# EAGLE design HP32W_proto (EAGLE 7.2.0)
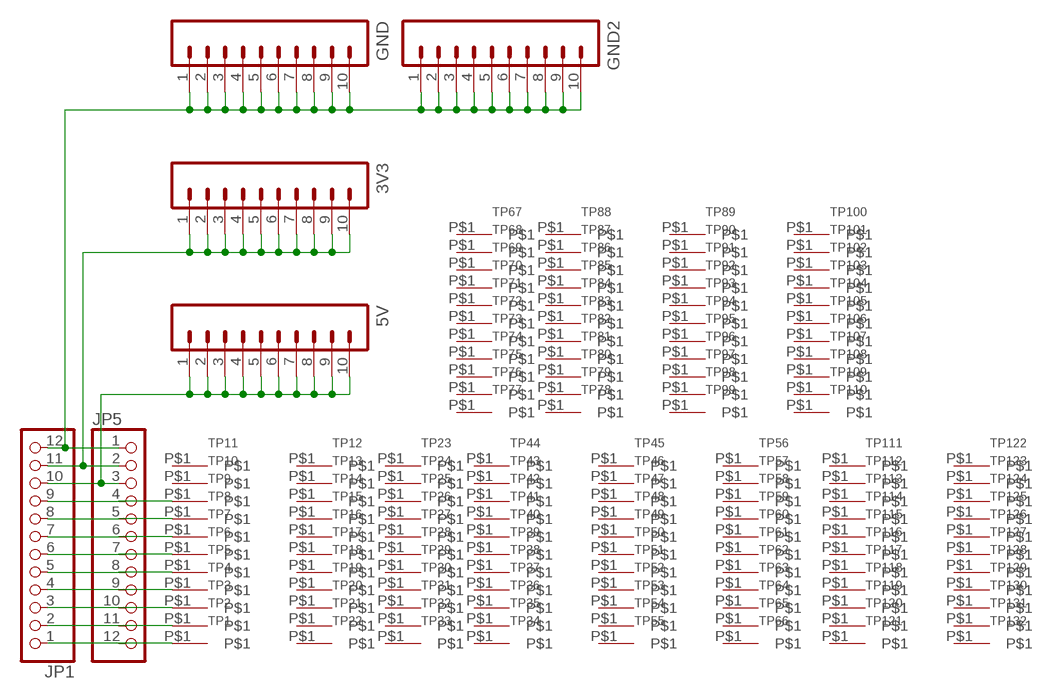
[diagram p0: schematic, sheet 1]

## Parts
3V3  M10"  [1X10]
5V  M10"  [1X10]
GND  M10"  [1X10]
GND2  M10"  [1X10]
JP1  PINHD-1X12-CB  [1X12-CB]
JP5  PINHD-1X12-CB  [1X12-CB]
TP1  FLOWERPIN  [FLOWERPIN]
TP2  FLOWERPIN  [FLOWERPIN]
TP3  FLOWERPIN  [FLOWERPIN]
TP4  FLOWERPIN  [FLOWERPIN]
TP5  FLOWERPIN  [FLOWERPIN]
TP6  FLOWERPIN  [FLOWERPIN]
TP7  FLOWERPIN  [FLOWERPIN]
TP8  FLOWERPIN  [FLOWERPIN]
TP9  FLOWERPIN  [FLOWERPIN]
TP10  FLOWERPIN  [FLOWERPIN]
TP11  FLOWERPIN  [FLOWERPIN]
TP12  FLOWERPIN  [FLOWERPIN]
TP13  FLOWERPIN  [FLOWERPIN]
TP14  FLOWERPIN  [FLOWERPIN]
TP15  FLOWERPIN  [FLOWERPIN]
TP16  FLOWERPIN  [FLOWERPIN]
TP17  FLOWERPIN  [FLOWERPIN]
TP18  FLOWERPIN  [FLOWERPIN]
TP19  FLOWERPIN  [FLOWERPIN]
TP20  FLOWERPIN  [FLOWERPIN]
TP21  FLOWERPIN  [FLOWERPIN]
TP22  FLOWERPIN  [FLOWERPIN]
TP23  FLOWERPIN  [FLOWERPIN]
TP24  FLOWERPIN  [FLOWERPIN]
TP25  FLOWERPIN  [FLOWERPIN]
TP26  FLOWERPIN  [FLOWERPIN]
TP27  FLOWERPIN  [FLOWERPIN]
TP28  FLOWERPIN  [FLOWERPIN]
TP29  FLOWERPIN  [FLOWERPIN]
TP30  FLOWERPIN  [FLOWERPIN]
TP31  FLOWERPIN  [FLOWERPIN]
TP32  FLOWERPIN  [FLOWERPIN]
TP33  FLOWERPIN  [FLOWERPIN]
TP34  FLOWERPIN  [FLOWERPIN]
TP35  FLOWERPIN  [FLOWERPIN]
TP36  FLOWERPIN  [FLOWERPIN]
TP37  FLOWERPIN  [FLOWERPIN]
TP38  FLOWERPIN  [FLOWERPIN]
TP39  FLOWERPIN  [FLOWERPIN]
TP40  FLOWERPIN  [FLOWERPIN]
TP41  FLOWERPIN  [FLOWERPIN]
TP42  FLOWERPIN  [FLOWERPIN]
TP43  FLOWERPIN  [FLOWERPIN]
TP44  FLOWERPIN  [FLOWERPIN]
TP45  FLOWERPIN  [FLOWERPIN]
TP46  FLOWERPIN  [FLOWERPIN]
TP47  FLOWERPIN  [FLOWERPIN]
TP48  FLOWERPIN  [FLOWERPIN]
TP49  FLOWERPIN  [FLOWERPIN]
TP50  FLOWERPIN  [FLOWERPIN]
TP51  FLOWERPIN  [FLOWERPIN]
TP52  FLOWERPIN  [FLOWERPIN]
TP53  FLOWERPIN  [FLOWERPIN]
TP54  FLOWERPIN  [FLOWERPIN]
TP55  FLOWERPIN  [FLOWERPIN]
TP56  FLOWERPIN  [FLOWERPIN]
TP57  FLOWERPIN  [FLOWERPIN]
TP58  FLOWERPIN  [FLOWERPIN]
TP59  FLOWERPIN  [FLOWERPIN]
TP60  FLOWERPIN  [FLOWERPIN]
TP61  FLOWERPIN  [FLOWERPIN]
TP62  FLOWERPIN  [FLOWERPIN]
TP63  FLOWERPIN  [FLOWERPIN]
TP64  FLOWERPIN  [FLOWERPIN]
TP65  FLOWERPIN  [FLOWERPIN]
TP66  FLOWERPIN  [FLOWERPIN]
TP67  FLOWERPIN  [FLOWERPIN]
TP68  FLOWERPIN  [FLOWERPIN]
TP69  FLOWERPIN  [FLOWERPIN]
TP70  FLOWERPIN  [FLOWERPIN]
TP71  FLOWERPIN  [FLOWERPIN]
TP72  FLOWERPIN  [FLOWERPIN]
TP73  FLOWERPIN  [FLOWERPIN]
TP74  FLOWERPIN  [FLOWERPIN]
TP75  FLOWERPIN  [FLOWERPIN]
TP76  FLOWERPIN  [FLOWERPIN]
TP77  FLOWERPIN  [FLOWERPIN]
TP78  FLOWERPIN  [FLOWERPIN]
TP79  FLOWERPIN  [FLOWERPIN]
TP80  FLOWERPIN  [FLOWERPIN]
TP81  FLOWERPIN  [FLOWERPIN]
TP82  FLOWERPIN  [FLOWERPIN]
TP83  FLOWERPIN  [FLOWERPIN]
TP84  FLOWERPIN  [FLOWERPIN]
TP85  FLOWERPIN  [FLOWERPIN]
TP86  FLOWERPIN  [FLOWERPIN]
TP87  FLOWERPIN  [FLOWERPIN]
TP88  FLOWERPIN  [FLOWERPIN]
TP89  FLOWERPIN  [FLOWERPIN]
TP90  FLOWERPIN  [FLOWERPIN]
TP91  FLOWERPIN  [FLOWERPIN]
TP92  FLOWERPIN  [FLOWERPIN]
TP93  FLOWERPIN  [FLOWERPIN]
TP94  FLOWERPIN  [FLOWERPIN]
TP95  FLOWERPIN  [FLOWERPIN]
TP96  FLOWERPIN  [FLOWERPIN]
TP97  FLOWERPIN  [FLOWERPIN]
TP98  FLOWERPIN  [FLOWERPIN]
TP99  FLOWERPIN  [FLOWERPIN]
TP100  FLOWERPIN  [FLOWERPIN]
TP101  FLOWERPIN  [FLOWERPIN]
TP102  FLOWERPIN  [FLOWERPIN]
TP103  FLOWERPIN  [FLOWERPIN]
TP104  FLOWERPIN  [FLOWERPIN]
TP105  FLOWERPIN  [FLOWERPIN]
TP106  FLOWERPIN  [FLOWERPIN]
TP107  FLOWERPIN  [FLOWERPIN]
TP108  FLOWERPIN  [FLOWERPIN]
TP109  FLOWERPIN  [FLOWERPIN]
TP110  FLOWERPIN  [FLOWERPIN]
TP111  FLOWERPIN  [FLOWERPIN]
TP112  FLOWERPIN  [FLOWERPIN]
TP113  FLOWERPIN  [FLOWERPIN]
TP114  FLOWERPIN  [FLOWERPIN]
TP115  FLOWERPIN  [FLOWERPIN]
TP116  FLOWERPIN  [FLOWERPIN]
TP117  FLOWERPIN  [FLOWERPIN]
TP118  FLOWERPIN  [FLOWERPIN]
TP119  FLOWERPIN  [FLOWERPIN]
TP120  FLOWERPIN  [FLOWERPIN]
TP121  FLOWERPIN  [FLOWERPIN]
TP122  FLOWERPIN  [FLOWERPIN]
TP123  FLOWERPIN  [FLOWERPIN]
TP124  FLOWERPIN  [FLOWERPIN]
TP125  FLOWERPIN  [FLOWERPIN]
TP126  FLOWERPIN  [FLOWERPIN]
TP127  FLOWERPIN  [FLOWERPIN]
TP128  FLOWERPIN  [FLOWERPIN]
TP129  FLOWERPIN  [FLOWERPIN]
TP130  FLOWERPIN  [FLOWERPIN]
TP131  FLOWERPIN  [FLOWERPIN]
TP132  FLOWERPIN  [FLOWERPIN]

## Nets
N$1: GND2.1 GND2.2 GND2.3 GND2.4 GND2.5 GND2.6 GND2.7 GND2.8 GND2.9 GND2.10 GND.1 GND.2 GND.3 GND.4 GND.5 GND.6 GND.7 GND.8 GND.9 GND.10 JP1.12 JP5.1
N$2: 3V3.1 3V3.2 3V3.3 3V3.4 3V3.5 3V3.6 3V3.7 3V3.8 3V3.9 3V3.10 JP1.11 JP5.2
N$3: 5V.1 5V.2 5V.3 5V.4 5V.5 5V.6 5V.7 5V.8 5V.9 5V.10 JP1.10 JP5.3
N$4: JP1.9 JP5.4 TP9.P$1
N$5: JP1.8 JP5.5 TP8.P$1
N$6: JP1.7 JP5.6 TP7.P$1
N$7: JP1.6 JP5.7 TP6.P$1
N$8: JP1.5 JP5.8 TP5.P$1
N$9: JP1.4 JP5.9 TP4.P$1
N$10: JP1.3 JP5.10 TP3.P$1
N$11: JP1.2 JP5.11 TP2.P$1
N$12: JP1.1 JP5.12 TP1.P$1
Unconnected: TP10.P$1 TP11.P$1 TP12.P$1 TP13.P$1 TP14.P$1 TP15.P$1 TP16.P$1 TP17.P$1 TP18.P$1 TP19.P$1 TP20.P$1 TP21.P$1 TP22.P$1 TP23.P$1 TP24.P$1 TP25.P$1 TP26.P$1 TP27.P$1 TP28.P$1 TP29.P$1 TP30.P$1 TP31.P$1 TP32.P$1 TP33.P$1 TP34.P$1 TP35.P$1 TP36.P$1 TP37.P$1 TP38.P$1 TP39.P$1 TP40.P$1 TP41.P$1 TP42.P$1 TP43.P$1 TP44.P$1 TP45.P$1 TP46.P$1 TP47.P$1 TP48.P$1 TP49.P$1 TP50.P$1 TP51.P$1 TP52.P$1 TP53.P$1 TP54.P$1 TP55.P$1 TP56.P$1 TP57.P$1 TP58.P$1 TP59.P$1 TP60.P$1 TP61.P$1 TP62.P$1 TP63.P$1 TP64.P$1 TP65.P$1 TP66.P$1 TP67.P$1 TP68.P$1 TP69.P$1 TP70.P$1 TP71.P$1 TP72.P$1 TP73.P$1 TP74.P$1 TP75.P$1 TP76.P$1 TP77.P$1 TP78.P$1 TP79.P$1 TP80.P$1 TP81.P$1 TP82.P$1 TP83.P$1 TP84.P$1 TP85.P$1 TP86.P$1 TP87.P$1 TP88.P$1 TP89.P$1 TP90.P$1 TP91.P$1 TP92.P$1 TP93.P$1 TP94.P$1 TP95.P$1 TP96.P$1 TP97.P$1 TP98.P$1 TP99.P$1 TP100.P$1 TP101.P$1 TP102.P$1 TP103.P$1 TP104.P$1 TP105.P$1 TP106.P$1 TP107.P$1 TP108.P$1 TP109.P$1 TP110.P$1 TP111.P$1 TP112.P$1 TP113.P$1 TP114.P$1 TP115.P$1 TP116.P$1 TP117.P$1 TP118.P$1 TP119.P$1 TP120.P$1 TP121.P$1 TP122.P$1 TP123.P$1 TP124.P$1 TP125.P$1 TP126.P$1 TP127.P$1 TP128.P$1 TP129.P$1 TP130.P$1 TP131.P$1 TP132.P$1

## Library data of the parts
3V3 5V GND GND2 = SparkFun-Connectors:M10: Header 10 Standard 10-pin 0.1" header. Use with straight break away headers (SKU : PRT-00116), right angle break away headers (PRT-00553), swiss pins (PRT-00743), machine pins (PRT-00117), and female headers (PRT-00115).
JP1 JP5 = adafruit:PINHD-1X12: PIN HEADER
TP1-TP132 = ZZFlowerpad:FLOWERPIN: Flower Pad Prototype

## Board
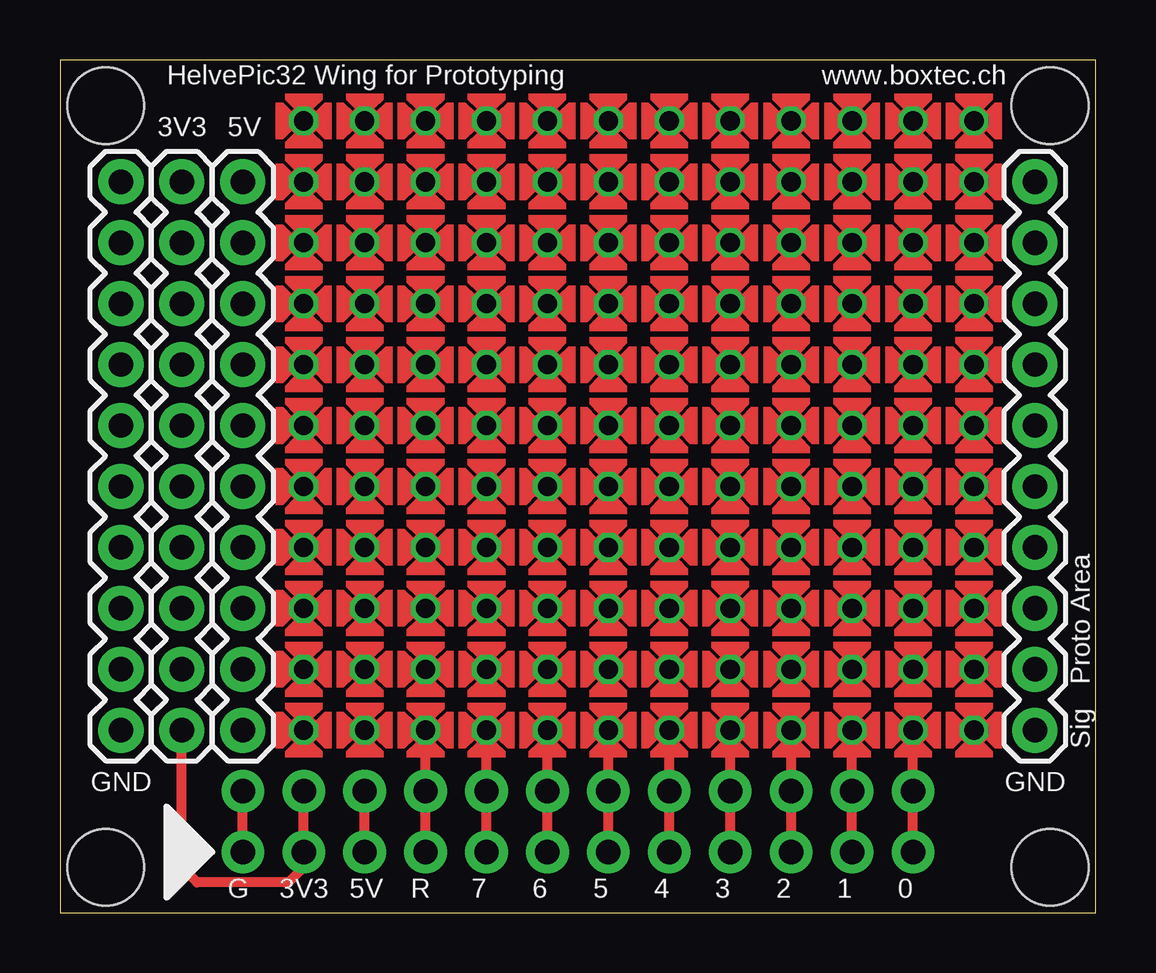
[diagram p1: board, top side]
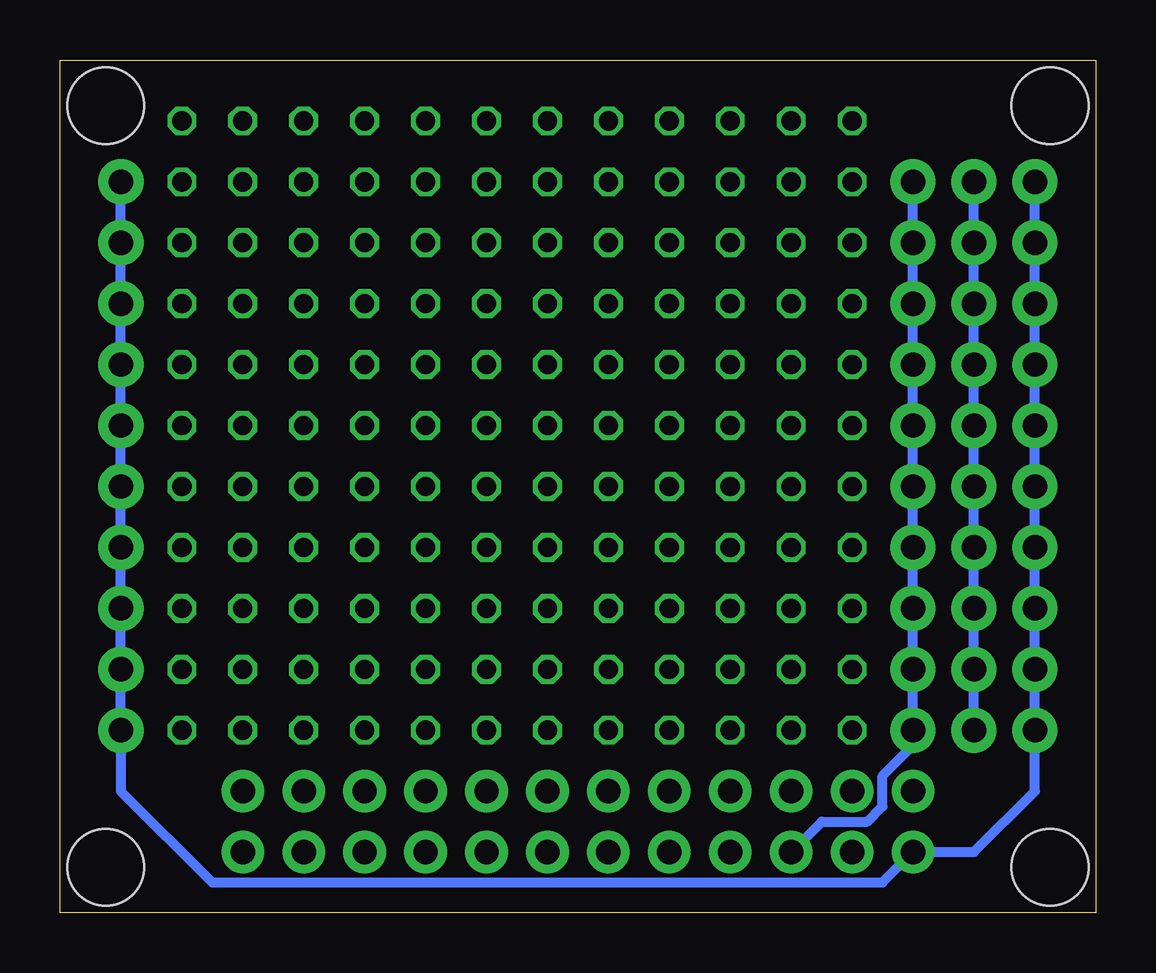
[diagram p2: board, bottom side, seen from below]

Size 43.18 x 35.56 mm. Coordinates in mm from the lower left corner, seen from the top.
Outline: 0,0 43.18,0 43.18,35.56 0,35.56 0,0
Copper layers (1*16): Top 0.0356mm / dielectric 1.5011mm / Bottom 0.0356mm
Design rules "OSHpark": minimum track width 6mil, minimum drill 13mil, track to track 6mil, track to pad 6mil, pad to pad 6mil, via to via 6mil, smd to smd 6mil, copper to edge 15mil, drill to drill 6mil, minimum pad ring 7mil, minimum via ring 7mil, stop-mask expansion 3mil, vias tented up to drill 0mil, thermal gap 10mil
Holes 3.2 mm at 1.91,33.66 1.91,1.91 41.27,1.91 41.27,33.66

### Footprints (pad centres in the part's own frame; a part is rotated, then mirrored left to right if it is on the bottom)
1X10 = drill 1.016 pad 1.88: 1 0,0; 2 2.54,0; 3 5.08,0; 4 7.62,0; 5 10.16,0; 6 12.7,0; 7 15.24,0; 8 17.78,0; 9 20.32,0; 10 22.86,0
1X12-CB = drill 1.016 pad 1.778: 1 -13.97,0; 2 -11.43,0; 3 -8.89,0; 4 -6.35,0; 5 -3.81,0; 6 -1.27,0; 7 1.27,0; 8 3.81,0; 9 6.35,0; 10 8.89,0; 11 11.43,0; 12 13.97,0
FLOWERPIN = drill 0.8 octagon: P$1 0,0

### Placement (x,y rotation side)
3V3  5.08,7.62 90 top
5V  7.62,7.62 90 top
GND  2.54,7.62 90 top
GND2  40.64,7.62 90 top
JP1  21.59,2.54 180 top
JP5  21.59,5.08 0 top
TP1  35.56,7.62 270 top
TP2  33.02,7.62 270 top
TP3  30.48,7.62 270 top
TP4  27.94,7.62 270 top
TP5  25.4,7.62 270 top
TP6  22.86,7.62 270 top
TP7  20.32,7.62 270 top
TP8  17.78,7.62 270 top
TP9  15.24,7.62 270 top
TP10  12.7,7.62 270 top
TP11  10.16,7.62 270 top
TP12  35.56,10.16 270 top
TP13  33.02,10.16 270 top
TP14  30.48,10.16 270 top
TP15  27.94,10.16 270 top
TP16  25.4,10.16 270 top
TP17  22.86,10.16 270 top
TP18  20.32,10.16 270 top
TP19  17.78,10.16 270 top
TP20  15.24,10.16 270 top
TP21  12.7,10.16 270 top
TP22  10.16,10.16 270 top
TP23  10.16,12.7 0 top
TP24  12.7,12.7 0 top
TP25  15.24,12.7 0 top
TP26  17.78,12.7 0 top
TP27  20.32,12.7 0 top
TP28  22.86,12.7 0 top
TP29  25.4,12.7 0 top
TP30  27.94,12.7 0 top
TP31  30.48,12.7 0 top
TP32  33.02,12.7 0 top
TP33  35.56,12.7 0 top
TP34  10.16,15.24 0 top
TP35  12.7,15.24 0 top
TP36  15.24,15.24 0 top
TP37  17.78,15.24 0 top
TP38  20.32,15.24 0 top
TP39  10.16,27.94 0 top
TP40  12.7,27.94 0 top
TP41  15.24,27.94 0 top
TP42  17.78,27.94 0 top
TP43  20.32,27.94 0 top
TP44  10.16,25.4 0 top
TP45  12.7,25.4 0 top
TP46  15.24,25.4 0 top
TP47  17.78,25.4 0 top
TP48  20.32,25.4 0 top
TP49  10.16,22.86 0 top
TP50  12.7,22.86 0 top
TP51  15.24,22.86 0 top
TP52  17.78,22.86 0 top
TP53  20.32,22.86 0 top
TP54  10.16,20.32 0 top
TP55  12.7,20.32 0 top
TP56  15.24,20.32 0 top
TP57  17.78,20.32 0 top
TP58  20.32,20.32 0 top
TP59  10.16,17.78 0 top
TP60  12.7,17.78 0 top
TP61  15.24,17.78 0 top
TP62  17.78,17.78 0 top
TP63  20.32,17.78 0 top
TP64  22.86,15.24 0 top
TP65  25.4,15.24 0 top
TP66  27.94,15.24 0 top
TP67  22.86,27.94 0 top
TP68  25.4,27.94 0 top
TP69  27.94,27.94 0 top
TP70  30.48,27.94 0 top
TP71  33.02,27.94 0 top
TP72  35.56,27.94 0 top
TP73  22.86,25.4 0 top
TP74  25.4,25.4 0 top
TP75  27.94,25.4 0 top
TP76  30.48,25.4 0 top
TP77  33.02,25.4 0 top
TP78  35.56,25.4 0 top
TP79  22.86,22.86 0 top
TP80  25.4,22.86 0 top
TP81  27.94,22.86 0 top
TP82  30.48,22.86 0 top
TP83  33.02,22.86 0 top
TP84  35.56,22.86 0 top
TP85  22.86,20.32 0 top
TP86  25.4,20.32 0 top
TP87  27.94,20.32 0 top
TP88  30.48,20.32 0 top
TP89  33.02,20.32 0 top
TP90  35.56,20.32 0 top
TP91  22.86,17.78 0 top
TP92  25.4,17.78 0 top
TP93  27.94,17.78 0 top
TP94  30.48,17.78 0 top
TP95  33.02,17.78 0 top
TP96  35.56,17.78 0 top
TP97  10.16,30.48 0 top
TP98  12.7,30.48 0 top
TP99  15.24,30.48 0 top
TP100  17.78,30.48 0 top
TP101  20.32,30.48 0 top
TP102  22.86,30.48 0 top
TP103  25.4,30.48 0 top
TP104  27.94,30.48 0 top
TP105  30.48,30.48 0 top
TP106  33.02,30.48 0 top
TP107  35.56,30.48 0 top
TP108  38.1,30.48 0 top
TP109  30.48,15.24 0 top
TP110  33.02,15.24 0 top
TP111  10.16,33.02 0 top
TP112  12.7,33.02 0 top
TP113  15.24,33.02 0 top
TP114  17.78,33.02 0 top
TP115  20.32,33.02 0 top
TP116  22.86,33.02 0 top
TP117  25.4,33.02 0 top
TP118  27.94,33.02 0 top
TP119  30.48,33.02 0 top
TP120  33.02,33.02 0 top
TP121  35.56,33.02 0 top
TP122  38.1,33.02 0 top
TP123  38.1,20.32 90 top
TP124  38.1,22.86 90 top
TP125  38.1,25.4 90 top
TP126  38.1,27.94 90 top
TP127  38.1,10.16 90 top
TP128  38.1,12.7 90 top
TP129  38.1,15.24 90 top
TP130  38.1,17.78 90 top
TP131  35.56,15.24 0 top
TP132  38.1,7.62 0 top

### Tracks (layer width: path | path; a pad name or v marks a point on that pad's centre or on a via)
N$1
  Top 0.406: JP1.12 JP5.1
  Bottom 0.406: GND.10 GND.9 GND.8 GND.7 GND.6 GND.5 GND.4 GND.3 GND.2 GND.1 2.54,5.08 5.08,2.54 JP1.12 8.89,1.27 36.83,1.27 40.64,5.08 GND2.1 GND2.2 GND2.3 GND2.4 GND2.5 GND2.6 GND2.7 GND2.8 GND2.9 GND2.10
N$2
  Top 0.406: JP5.2 JP1.11 10.16,1.91 9.53,1.27 5.71,1.27 5.08,1.91 3V3.1
  Bottom 0.406: 3V3.1 3V3.2 3V3.3 3V3.4 3V3.5 3V3.6 3V3.7 3V3.8 3V3.9 3V3.10
N$3
  Top 0.406: JP1.10 JP5.3
  Bottom 0.406: JP1.10 11.43,3.81 9.53,3.81 8.89,4.45 8.89,5.71 7.62,6.99 5V.1 5V.2 5V.3 5V.4 5V.5 5V.6 5V.7 5V.8 5V.9 5V.10
N$4
  Top 0.406: JP1.9 JP5.4 TP9.P$1
N$5
  Top 0.406: JP1.8 JP5.5 TP8.P$1
N$6
  Top 0.406: JP1.7 JP5.6 TP7.P$1
N$7
  Top 0.406: JP1.6 JP5.7 TP6.P$1
N$8
  Top 0.406: JP1.5 JP5.8 TP5.P$1
N$9
  Top 0.406: JP1.4 JP5.9 TP4.P$1
N$10
  Top 0.406: JP1.3 JP5.10 TP3.P$1
N$11
  Top 0.406: JP1.2 JP5.11 TP2.P$1
N$12
  Top 0.406: JP1.1 JP5.12 TP1.P$1

### Text on the board
tNames: HelvePic32 Wing for Prototyping | www.boxtec.ch | 3V3 | 5V | Proto Area | Sig | GND | GND | G | 3V3 | 5V | R | 7 | 6 | 5 | 4 | 3 | 2 | 1 | 0